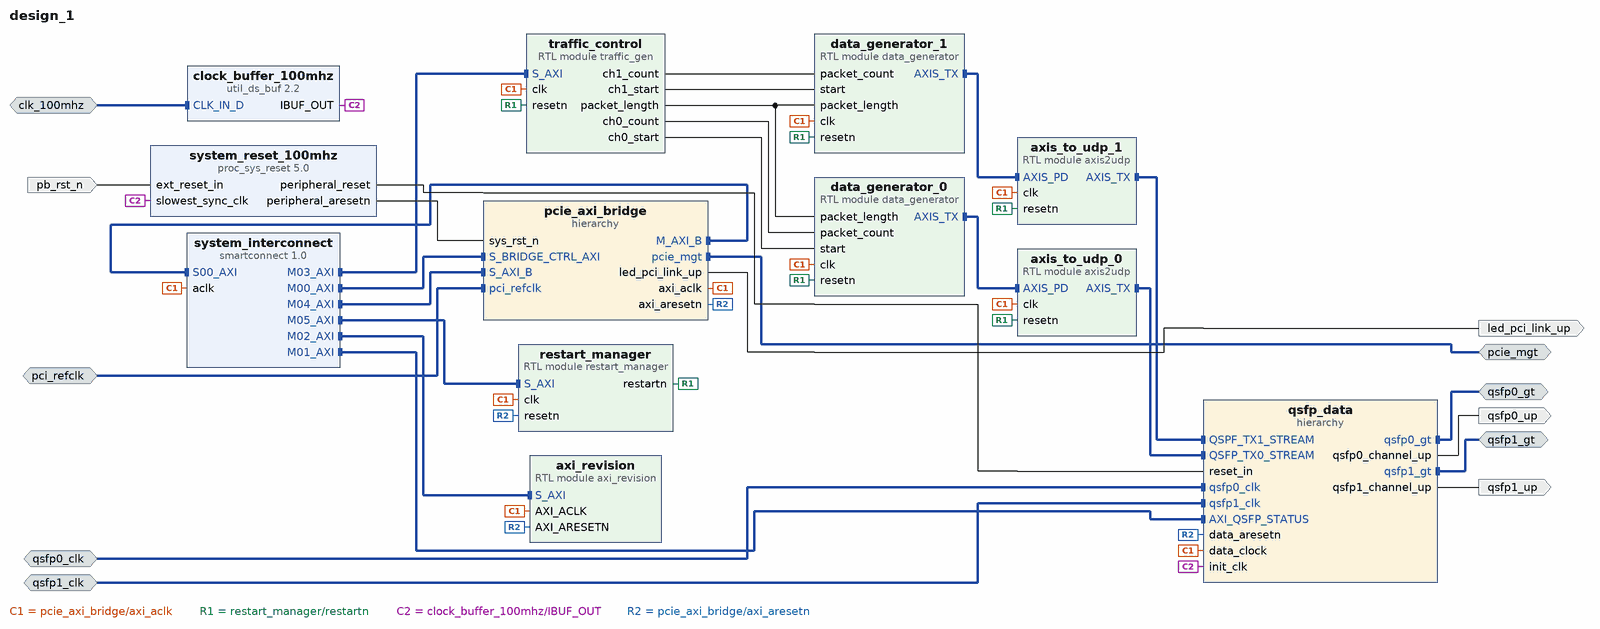
[diagram p0: block diagram of the top level]
# Vivado block design design_1, xczu19eg-ffvc1760-2-i, Vivado 2021.1
create_bd_design design_1

create_bd_intf_port -mode Slave -vlnv xilinx.com:interface:diff_clock_rtl:1.0 clk_100mhz
create_bd_intf_port -mode Slave -vlnv xilinx.com:interface:diff_clock_rtl:1.0 pci_refclk
create_bd_intf_port -mode Master -vlnv xilinx.com:interface:pcie_7x_mgt_rtl:1.0 pcie_mgt
create_bd_intf_port -mode Slave -vlnv xilinx.com:interface:diff_clock_rtl:1.0 qsfp0_clk
set_property -dict {CONFIG.FREQ_HZ 322265625} [get_bd_intf_ports qsfp0_clk]
create_bd_intf_port -mode Slave -vlnv xilinx.com:interface:diff_clock_rtl:1.0 qsfp1_clk
set_property -dict {CONFIG.FREQ_HZ 322265625} [get_bd_intf_ports qsfp1_clk]
create_bd_intf_port -mode Master -vlnv xilinx.com:interface:gt_rtl:1.0 qsfp0_gt
create_bd_intf_port -mode Master -vlnv xilinx.com:interface:gt_rtl:1.0 qsfp1_gt
create_bd_port -dir I -type rst pb_rst_n
create_bd_port -dir O led_pci_link_up
create_bd_port -dir O qsfp0_up
create_bd_port -dir O qsfp1_up

create_bd_cell -type ip -vlnv xilinx.com:ip:proc_sys_reset:5.0 system_reset_100mhz
create_bd_cell -type ip -vlnv xilinx.com:ip:util_ds_buf:2.2 clock_buffer_100mhz
create_bd_cell -type hier pcie_axi_bridge
create_bd_cell -type hier qsfp_data
create_bd_cell -type module -reference restart_manager restart_manager
create_bd_cell -type ip -vlnv xilinx.com:ip:smartconnect:1.0 system_interconnect
set_property -dict {CONFIG.HAS_ARESETN 0 CONFIG.NUM_CLKS 1 CONFIG.NUM_MI 6 CONFIG.NUM_SI 1} [get_bd_cells system_interconnect]
create_bd_cell -type module -reference traffic_gen traffic_control
create_bd_cell -type module -reference axi_revision axi_revision
create_bd_cell -type module -reference data_generator data_generator_0
create_bd_cell -type module -reference data_generator data_generator_1
create_bd_cell -type module -reference axis2udp axis_to_udp_0
set_property -dict {CONFIG.DST_PORT 32002 CONFIG.SRC_MAC 2} [get_bd_cells axis_to_udp_0]
create_bd_cell -type module -reference axis2udp axis_to_udp_1
set_property -dict {CONFIG.DST_PORT 32003 CONFIG.SRC_IP3 3 CONFIG.SRC_MAC 3} [get_bd_cells axis_to_udp_1]

# ---- hierarchy /pcie_axi_bridge ----
current_bd_instance /pcie_axi_bridge
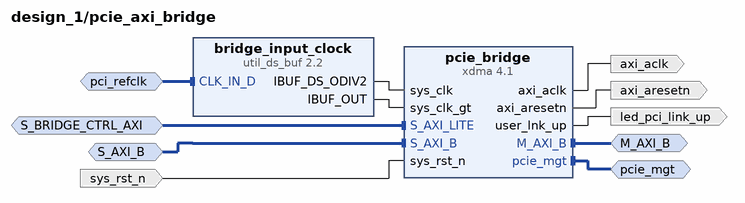
[diagram p1: block diagram inside /pcie_axi_bridge]
create_bd_intf_pin -mode Slave -vlnv xilinx.com:interface:aximm_rtl:1.0 S_BRIDGE_CTRL_AXI
create_bd_intf_pin -mode Slave -vlnv xilinx.com:interface:aximm_rtl:1.0 S_AXI_B
create_bd_intf_pin -mode Master -vlnv xilinx.com:interface:pcie_7x_mgt_rtl:1.0 pcie_mgt
create_bd_intf_pin -mode Master -vlnv xilinx.com:interface:aximm_rtl:1.0 M_AXI_B
create_bd_intf_pin -mode Slave -vlnv xilinx.com:interface:diff_clock_rtl:1.0 pci_refclk
create_bd_pin -dir O -type rst axi_aresetn
create_bd_pin -dir O -type clk axi_aclk
create_bd_pin -dir O led_pci_link_up
create_bd_pin -dir I -type rst sys_rst_n

create_bd_cell -type ip -vlnv xilinx.com:ip:xdma:4.1 pcie_bridge
set_property -dict [list \
  CONFIG.PF0_DEVICE_ID_mqdma 903F \
  CONFIG.PF0_SRIOV_VF_DEVICE_ID A03F \
  CONFIG.PF2_DEVICE_ID_mqdma 923F \
  CONFIG.PF3_DEVICE_ID_mqdma 933F \
  CONFIG.axi_addr_width 64 \
  CONFIG.axi_data_width 512_bit \
  CONFIG.axibar2pciebar_0 0x0 \
  CONFIG.axibar_num 1 \
  CONFIG.axilite_master_en true \
  CONFIG.axilite_master_size 8 \
  CONFIG.axisten_freq 250 \
  CONFIG.bridge_burst true \
  CONFIG.c_s_axi_supports_narrow_burst false \
  CONFIG.cfg_mgmt_if false \
  CONFIG.enable_jtag_dbg true \
  CONFIG.functional_mode AXI_Bridge \
  CONFIG.mode_selection Advanced \
  CONFIG.pcie_blk_locn X1Y0 \
  CONFIG.pcie_extended_tag false \
  CONFIG.pciebar2axibar_0 0x00000000 \
  CONFIG.pciebar2axibar_1 0x800000000 \
  CONFIG.pciebar2axibar_axil_master 0A0000000 \
  CONFIG.pf0_Use_Class_Code_Lookup_Assistant false \
  CONFIG.pf0_bar0_64bit false \
  CONFIG.pf0_bar0_scale Megabytes \
  CONFIG.pf0_bar0_size 1 \
  CONFIG.pf0_bar1_enabled true \
  CONFIG.pf0_bar1_scale Megabytes \
  CONFIG.pf0_bar1_size 1 \
  CONFIG.pf0_bar2_enabled false \
  CONFIG.pf0_base_class_menu Simple_communication_controllers \
  CONFIG.pf0_class_code_base 07 \
  CONFIG.pf0_class_code_interface 01 \
  CONFIG.pf0_class_code_sub 00 \
  CONFIG.pf0_device_id 903F \
  CONFIG.pf0_interrupt_pin INTA \
  CONFIG.pf0_msi_enabled false \
  CONFIG.pf0_sub_class_interface_menu 16450_compatible_serial_controller \
  CONFIG.pf0_subsystem_id 0007 \
  CONFIG.pl_link_cap_max_link_speed 8.0_GT/s \
  CONFIG.pl_link_cap_max_link_width X16 \
  CONFIG.plltype QPLL1 \
  CONFIG.xdma_num_usr_irq 1 \
  CONFIG.xdma_sts_ports false \
  CONFIG.xdma_wnum_rids 32 \
] [get_bd_cells pcie_bridge]
create_bd_cell -type ip -vlnv xilinx.com:ip:util_ds_buf:2.2 bridge_input_clock
set_property -dict {CONFIG.C_BUF_TYPE IBUFDSGTE} [get_bd_cells bridge_input_clock]

# ---- hierarchy /qsfp_data ----
current_bd_instance /qsfp_data
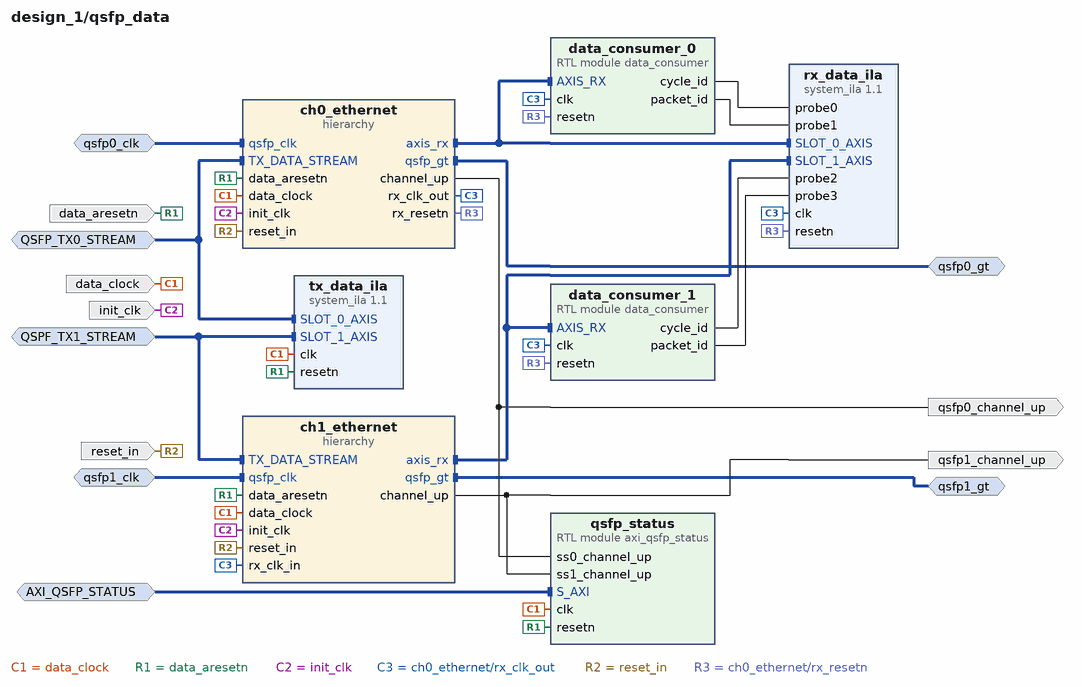
[diagram p2: block diagram inside /qsfp_data]
create_bd_intf_pin -mode Slave -vlnv xilinx.com:interface:diff_clock_rtl:1.0 qsfp0_clk
create_bd_intf_pin -mode Slave -vlnv xilinx.com:interface:diff_clock_rtl:1.0 qsfp1_clk
create_bd_intf_pin -mode Slave -vlnv xilinx.com:interface:axis_rtl:1.0 QSFP_TX0_STREAM
create_bd_intf_pin -mode Slave -vlnv xilinx.com:interface:aximm_rtl:1.0 AXI_QSFP_STATUS
create_bd_intf_pin -mode Master -vlnv xilinx.com:interface:gt_rtl:1.0 qsfp0_gt
create_bd_intf_pin -mode Master -vlnv xilinx.com:interface:gt_rtl:1.0 qsfp1_gt
create_bd_intf_pin -mode Slave -vlnv xilinx.com:interface:axis_rtl:1.0 QSPF_TX1_STREAM
create_bd_pin -dir I -type clk init_clk
create_bd_pin -dir I -type rst reset_in
create_bd_pin -dir O qsfp0_channel_up
create_bd_pin -dir O qsfp1_channel_up
create_bd_pin -dir I -type clk data_clock
create_bd_pin -dir I -type rst data_aresetn

create_bd_cell -type hier ch0_ethernet
create_bd_cell -type hier ch1_ethernet
create_bd_cell -type module -reference axi_qsfp_status qsfp_status
create_bd_cell -type ip -vlnv xilinx.com:ip:system_ila:1.1 tx_data_ila
set_property -dict [list \
  CONFIG.C_DATA_DEPTH 2048 \
  CONFIG.C_MON_TYPE INTERFACE \
  CONFIG.C_NUM_MONITOR_SLOTS 2 \
  CONFIG.C_NUM_OF_PROBES 1 \
  CONFIG.C_PROBE0_TYPE 0 \
  CONFIG.C_PROBE1_TYPE 0 \
  CONFIG.C_SLOT 1 \
  CONFIG.C_SLOT_0_INTF_TYPE xilinx.com:interface:axis_rtl:1.0 \
  CONFIG.C_SLOT_1_INTF_TYPE xilinx.com:interface:axis_rtl:1.0 \
] [get_bd_cells tx_data_ila]
create_bd_cell -type module -reference data_consumer data_consumer_0
create_bd_cell -type module -reference data_consumer data_consumer_1
create_bd_cell -type ip -vlnv xilinx.com:ip:system_ila:1.1 rx_data_ila
set_property -dict [list \
  CONFIG.C_MON_TYPE MIX \
  CONFIG.C_NUM_MONITOR_SLOTS 2 \
  CONFIG.C_NUM_OF_PROBES 4 \
  CONFIG.C_PROBE0_TYPE 0 \
  CONFIG.C_PROBE1_TYPE 0 \
  CONFIG.C_PROBE2_TYPE 0 \
  CONFIG.C_PROBE3_TYPE 0 \
  CONFIG.C_SLOT_0_APC_EN 0 \
  CONFIG.C_SLOT_0_AXI_DATA_SEL 1 \
  CONFIG.C_SLOT_0_AXI_TRIG_SEL 1 \
  CONFIG.C_SLOT_0_INTF_TYPE xilinx.com:interface:axis_rtl:1.0 \
  CONFIG.C_SLOT_1_APC_EN 0 \
  CONFIG.C_SLOT_1_AXI_DATA_SEL 1 \
  CONFIG.C_SLOT_1_AXI_TRIG_SEL 1 \
  CONFIG.C_SLOT_1_INTF_TYPE xilinx.com:interface:axis_rtl:1.0 \
] [get_bd_cells rx_data_ila]

# ---- hierarchy /qsfp_data/ch0_ethernet ----
current_bd_instance /qsfp_data/ch0_ethernet
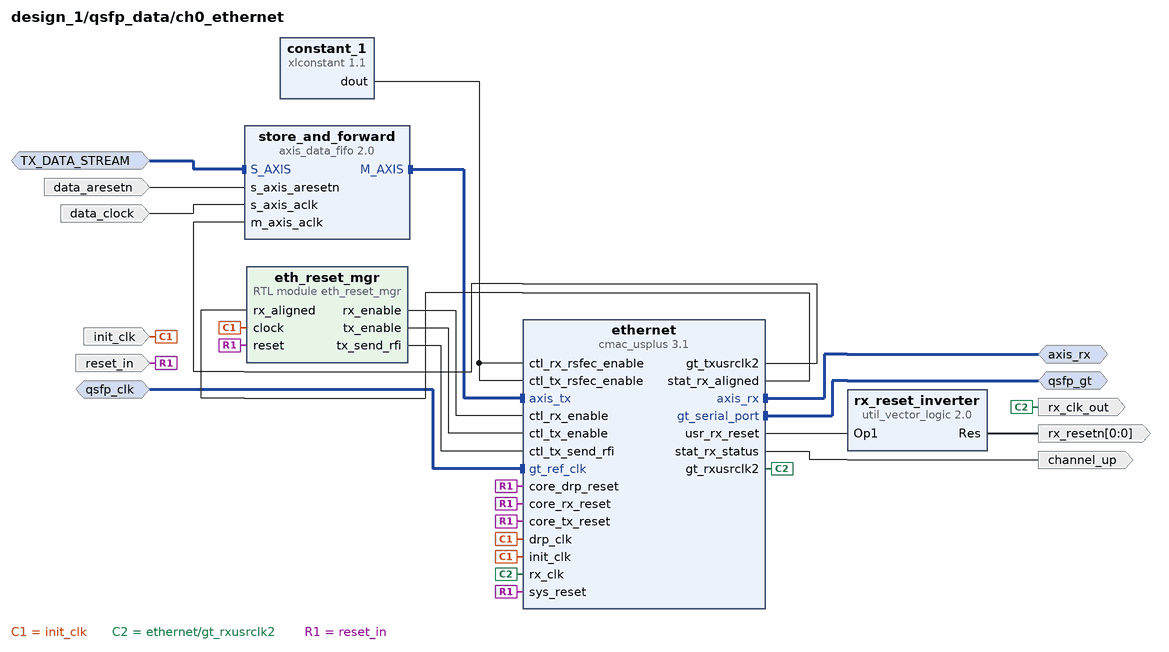
[diagram p3: block diagram inside /qsfp_data/ch0_ethernet]
create_bd_intf_pin -mode Master -vlnv xilinx.com:interface:gt_rtl:1.0 qsfp_gt
create_bd_intf_pin -mode Slave -vlnv xilinx.com:interface:diff_clock_rtl:1.0 qsfp_clk
create_bd_intf_pin -mode Master -vlnv xilinx.com:interface:axis_rtl:1.0 axis_rx
create_bd_intf_pin -mode Slave -vlnv xilinx.com:interface:axis_rtl:1.0 TX_DATA_STREAM
create_bd_pin -dir I -type rst reset_in
create_bd_pin -dir I -type clk init_clk
create_bd_pin -dir O -type clk rx_clk_out
create_bd_pin -dir O channel_up
create_bd_pin -dir I -type rst data_aresetn
create_bd_pin -dir I -type clk data_clock
create_bd_pin -dir O -from 0 -to 0 rx_resetn

create_bd_cell -type ip -vlnv xilinx.com:ip:cmac_usplus:3.1 ethernet
set_property -dict [list \
  CONFIG.CMAC_CAUI4_MODE 1 \
  CONFIG.CMAC_CORE_SELECT CMACE4_X0Y1 \
  CONFIG.GT_GROUP_SELECT {X0Y12~X0Y15} \
  CONFIG.GT_REF_CLK_FREQ 322.265625 \
  CONFIG.INCLUDE_RS_FEC 1 \
  CONFIG.INS_LOSS_NYQ 20 \
  CONFIG.NUM_LANES 4x25 \
  CONFIG.RX_FLOW_CONTROL 0 \
  CONFIG.TX_FLOW_CONTROL 0 \
  CONFIG.USER_INTERFACE AXIS \
] [get_bd_cells ethernet]
create_bd_cell -type module -reference eth_reset_mgr eth_reset_mgr
create_bd_cell -type ip -vlnv xilinx.com:ip:util_vector_logic:2.0 rx_reset_inverter
set_property -dict {CONFIG.C_OPERATION not CONFIG.C_SIZE 1} [get_bd_cells rx_reset_inverter]
create_bd_cell -type ip -vlnv xilinx.com:ip:axis_data_fifo:2.0 store_and_forward
set_property -dict {CONFIG.FIFO_DEPTH 256 CONFIG.FIFO_MODE 2 CONFIG.IS_ACLK_ASYNC 1} [get_bd_cells store_and_forward]
create_bd_cell -type ip -vlnv xilinx.com:ip:xlconstant:1.1 constant_1

# ---- hierarchy /qsfp_data/ch1_ethernet ----
current_bd_instance /qsfp_data/ch1_ethernet
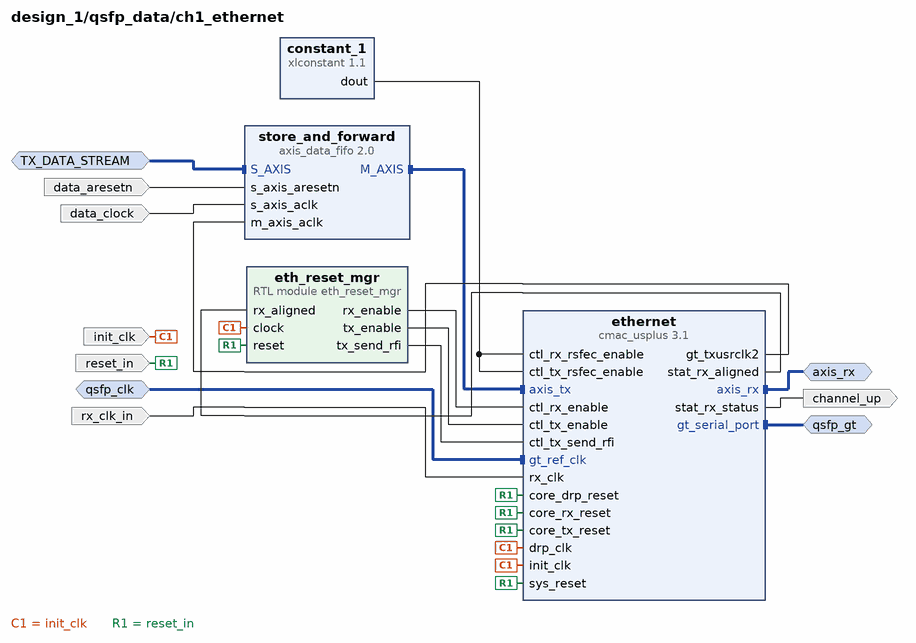
[diagram p4: block diagram inside /qsfp_data/ch1_ethernet]
create_bd_intf_pin -mode Master -vlnv xilinx.com:interface:gt_rtl:1.0 qsfp_gt
create_bd_intf_pin -mode Slave -vlnv xilinx.com:interface:diff_clock_rtl:1.0 qsfp_clk
create_bd_intf_pin -mode Master -vlnv xilinx.com:interface:axis_rtl:1.0 axis_rx
create_bd_intf_pin -mode Slave -vlnv xilinx.com:interface:axis_rtl:1.0 TX_DATA_STREAM
create_bd_pin -dir I -type rst reset_in
create_bd_pin -dir I -type clk init_clk
create_bd_pin -dir O channel_up
create_bd_pin -dir I -type rst data_aresetn
create_bd_pin -dir I -type clk data_clock
create_bd_pin -dir I -type clk rx_clk_in

create_bd_cell -type ip -vlnv xilinx.com:ip:cmac_usplus:3.1 ethernet
set_property -dict [list \
  CONFIG.CMAC_CAUI4_MODE 1 \
  CONFIG.CMAC_CORE_SELECT CMACE4_X0Y2 \
  CONFIG.GT_GROUP_SELECT {X0Y16~X0Y19} \
  CONFIG.GT_REF_CLK_FREQ 322.265625 \
  CONFIG.INCLUDE_RS_FEC 1 \
  CONFIG.INS_LOSS_NYQ 20 \
  CONFIG.NUM_LANES 4x25 \
  CONFIG.RX_FLOW_CONTROL 0 \
  CONFIG.TX_FLOW_CONTROL 0 \
  CONFIG.USER_INTERFACE AXIS \
] [get_bd_cells ethernet]
create_bd_cell -type module -reference eth_reset_mgr eth_reset_mgr
create_bd_cell -type ip -vlnv xilinx.com:ip:axis_data_fifo:2.0 store_and_forward
set_property -dict {CONFIG.FIFO_DEPTH 256 CONFIG.FIFO_MODE 2 CONFIG.IS_ACLK_ASYNC 1} [get_bd_cells store_and_forward]
create_bd_cell -type ip -vlnv xilinx.com:ip:xlconstant:1.1 constant_1

# ---- connections ----

current_bd_instance /pcie_axi_bridge
connect_bd_intf_net [get_bd_intf_pins S_BRIDGE_CTRL_AXI] [get_bd_intf_pins pcie_bridge/S_AXI_LITE]
connect_bd_intf_net [get_bd_intf_pins pcie_mgt] [get_bd_intf_pins pcie_bridge/pcie_mgt]
connect_bd_intf_net [get_bd_intf_pins M_AXI_B] [get_bd_intf_pins pcie_bridge/M_AXI_B]
connect_bd_intf_net [get_bd_intf_pins pci_refclk] [get_bd_intf_pins bridge_input_clock/CLK_IN_D]
connect_bd_intf_net [get_bd_intf_pins S_AXI_B] [get_bd_intf_pins pcie_bridge/S_AXI_B]
connect_bd_net [get_bd_pins bridge_input_clock/IBUF_DS_ODIV2] [get_bd_pins pcie_bridge/sys_clk]
connect_bd_net [get_bd_pins bridge_input_clock/IBUF_OUT] [get_bd_pins pcie_bridge/sys_clk_gt]
connect_bd_net [get_bd_pins pcie_bridge/axi_aclk] [get_bd_pins axi_aclk]
connect_bd_net [get_bd_pins pcie_bridge/axi_aresetn] [get_bd_pins axi_aresetn]
connect_bd_net [get_bd_pins pcie_bridge/user_lnk_up] [get_bd_pins led_pci_link_up]
connect_bd_net [get_bd_pins sys_rst_n] [get_bd_pins pcie_bridge/sys_rst_n]

current_bd_instance /qsfp_data
connect_bd_intf_net [get_bd_intf_pins QSPF_TX1_STREAM] [get_bd_intf_pins ch1_ethernet/TX_DATA_STREAM]
connect_bd_intf_net [get_bd_intf_pins QSPF_TX1_STREAM] [get_bd_intf_pins tx_data_ila/SLOT_1_AXIS]
connect_bd_intf_net [get_bd_intf_pins qsfp1_gt] [get_bd_intf_pins ch1_ethernet/qsfp_gt]
connect_bd_intf_net [get_bd_intf_pins AXI_QSFP_STATUS] [get_bd_intf_pins qsfp_status/S_AXI]
connect_bd_intf_net [get_bd_intf_pins qsfp0_gt] [get_bd_intf_pins ch0_ethernet/qsfp_gt]
connect_bd_intf_net [get_bd_intf_pins QSFP_TX0_STREAM] [get_bd_intf_pins ch0_ethernet/TX_DATA_STREAM]
connect_bd_intf_net [get_bd_intf_pins QSFP_TX0_STREAM] [get_bd_intf_pins tx_data_ila/SLOT_0_AXIS]
connect_bd_intf_net [get_bd_intf_pins data_consumer_0/AXIS_RX] [get_bd_intf_pins ch0_ethernet/axis_rx]
connect_bd_intf_net [get_bd_intf_pins data_consumer_0/AXIS_RX] [get_bd_intf_pins rx_data_ila/SLOT_0_AXIS]
connect_bd_intf_net [get_bd_intf_pins data_consumer_1/AXIS_RX] [get_bd_intf_pins ch1_ethernet/axis_rx]
connect_bd_intf_net [get_bd_intf_pins data_consumer_1/AXIS_RX] [get_bd_intf_pins rx_data_ila/SLOT_1_AXIS]
connect_bd_intf_net [get_bd_intf_pins qsfp0_clk] [get_bd_intf_pins ch0_ethernet/qsfp_clk]
connect_bd_intf_net [get_bd_intf_pins qsfp1_clk] [get_bd_intf_pins ch1_ethernet/qsfp_clk]
connect_bd_net -net aclk_1 [get_bd_pins data_clock] \
  [get_bd_pins ch1_ethernet/data_clock] [get_bd_pins ch0_ethernet/data_clock] [get_bd_pins qsfp_status/clk] \
  [get_bd_pins tx_data_ila/clk]
connect_bd_net -net aresetn_1 [get_bd_pins data_aresetn] \
  [get_bd_pins ch1_ethernet/data_aresetn] [get_bd_pins ch0_ethernet/data_aresetn] [get_bd_pins qsfp_status/resetn] \
  [get_bd_pins tx_data_ila/resetn]
connect_bd_net -net aurora_64b66b_0_channel_up [get_bd_pins ch0_ethernet/channel_up] \
  [get_bd_pins qsfp0_channel_up] [get_bd_pins qsfp_status/ss0_channel_up]
connect_bd_net -net aurora_core_1_channel_up [get_bd_pins ch1_ethernet/channel_up] \
  [get_bd_pins qsfp1_channel_up] [get_bd_pins qsfp_status/ss1_channel_up]
connect_bd_net -net clock_1 [get_bd_pins init_clk] [get_bd_pins ch0_ethernet/init_clk] [get_bd_pins ch1_ethernet/init_clk]
connect_bd_net -net cycle_id_1 [get_bd_pins data_consumer_0/cycle_id] [get_bd_pins rx_data_ila/probe0]
connect_bd_net -net cycle_id_2 [get_bd_pins data_consumer_1/cycle_id] [get_bd_pins rx_data_ila/probe2]
connect_bd_net -net packet_id_1 [get_bd_pins data_consumer_0/packet_id] [get_bd_pins rx_data_ila/probe1]
connect_bd_net -net packet_id_2 [get_bd_pins data_consumer_1/packet_id] [get_bd_pins rx_data_ila/probe3]
connect_bd_net -net qsfp0_ethernet_gt_rxusrclk2 [get_bd_pins ch0_ethernet/rx_clk_out] \
  [get_bd_pins ch1_ethernet/rx_clk_in] [get_bd_pins data_consumer_0/clk] [get_bd_pins data_consumer_1/clk] \
  [get_bd_pins rx_data_ila/clk]
connect_bd_net [get_bd_pins reset_in] [get_bd_pins ch0_ethernet/reset_in] [get_bd_pins ch1_ethernet/reset_in]
connect_bd_net -net reset_inverter_1_Res [get_bd_pins ch0_ethernet/rx_resetn] \
  [get_bd_pins data_consumer_0/resetn] [get_bd_pins data_consumer_1/resetn] [get_bd_pins rx_data_ila/resetn]
set_property HDL_ATTRIBUTE.DEBUG true [get_bd_nets cycle_id_1]
set_property HDL_ATTRIBUTE.MARK_DEBUG true [get_bd_nets cycle_id_1]
set_property HDL_ATTRIBUTE.DEBUG true [get_bd_nets cycle_id_2]
set_property HDL_ATTRIBUTE.MARK_DEBUG true [get_bd_nets cycle_id_2]
set_property HDL_ATTRIBUTE.DEBUG true [get_bd_nets packet_id_1]
set_property HDL_ATTRIBUTE.MARK_DEBUG true [get_bd_nets packet_id_1]
set_property HDL_ATTRIBUTE.DEBUG true [get_bd_nets packet_id_2]
set_property HDL_ATTRIBUTE.MARK_DEBUG true [get_bd_nets packet_id_2]

current_bd_instance /qsfp_data/ch0_ethernet
connect_bd_intf_net [get_bd_intf_pins qsfp_gt] [get_bd_intf_pins ethernet/gt_serial_port]
connect_bd_intf_net [get_bd_intf_pins TX_DATA_STREAM] [get_bd_intf_pins store_and_forward/S_AXIS]
connect_bd_intf_net [get_bd_intf_pins qsfp_clk] [get_bd_intf_pins ethernet/gt_ref_clk]
connect_bd_intf_net [get_bd_intf_pins axis_rx] [get_bd_intf_pins ethernet/axis_rx]
connect_bd_intf_net [get_bd_intf_pins ethernet/axis_tx] [get_bd_intf_pins store_and_forward/M_AXIS]
connect_bd_net -net aurora_64b66b_0_channel_up [get_bd_pins ethernet/stat_rx_status] [get_bd_pins channel_up]
connect_bd_net -net clock_1 [get_bd_pins init_clk] [get_bd_pins ethernet/drp_clk] [get_bd_pins ethernet/init_clk] [get_bd_pins eth_reset_mgr/clock]
connect_bd_net [get_bd_pins constant_1/dout] [get_bd_pins ethernet/ctl_rx_rsfec_enable] [get_bd_pins ethernet/ctl_tx_rsfec_enable]
connect_bd_net [get_bd_pins data_aresetn] [get_bd_pins store_and_forward/s_axis_aresetn]
connect_bd_net [get_bd_pins data_clock] [get_bd_pins store_and_forward/s_axis_aclk]
connect_bd_net -net eth_reset_mgr_0_rx_enable [get_bd_pins eth_reset_mgr/rx_enable] [get_bd_pins ethernet/ctl_rx_enable]
connect_bd_net -net eth_reset_mgr_0_tx_enable [get_bd_pins eth_reset_mgr/tx_enable] [get_bd_pins ethernet/ctl_tx_enable]
connect_bd_net -net eth_reset_mgr_0_tx_send_rfi [get_bd_pins eth_reset_mgr/tx_send_rfi] [get_bd_pins ethernet/ctl_tx_send_rfi]
connect_bd_net [get_bd_pins ethernet/gt_txusrclk2] [get_bd_pins store_and_forward/m_axis_aclk]
connect_bd_net [get_bd_pins ethernet/stat_rx_aligned] [get_bd_pins eth_reset_mgr/rx_aligned]
connect_bd_net [get_bd_pins ethernet/usr_rx_reset] [get_bd_pins rx_reset_inverter/Op1]
connect_bd_net -net qsfp0_ethernet_gt_rxusrclk2 [get_bd_pins ethernet/gt_rxusrclk2] [get_bd_pins rx_clk_out] [get_bd_pins ethernet/rx_clk]
connect_bd_net [get_bd_pins reset_in] \
  [get_bd_pins ethernet/core_tx_reset] [get_bd_pins ethernet/core_rx_reset] [get_bd_pins ethernet/core_drp_reset] \
  [get_bd_pins ethernet/sys_reset] [get_bd_pins eth_reset_mgr/reset]
connect_bd_net [get_bd_pins rx_reset_inverter/Res] [get_bd_pins rx_resetn]

current_bd_instance /qsfp_data/ch1_ethernet
connect_bd_intf_net [get_bd_intf_pins qsfp_gt] [get_bd_intf_pins ethernet/gt_serial_port]
connect_bd_intf_net [get_bd_intf_pins TX_DATA_STREAM] [get_bd_intf_pins store_and_forward/S_AXIS]
connect_bd_intf_net [get_bd_intf_pins qsfp_clk] [get_bd_intf_pins ethernet/gt_ref_clk]
connect_bd_intf_net [get_bd_intf_pins axis_rx] [get_bd_intf_pins ethernet/axis_rx]
connect_bd_intf_net [get_bd_intf_pins store_and_forward/M_AXIS] [get_bd_intf_pins ethernet/axis_tx]
connect_bd_net -net aurora_core_1_channel_up [get_bd_pins ethernet/stat_rx_status] [get_bd_pins channel_up]
connect_bd_net -net clock_1 [get_bd_pins init_clk] [get_bd_pins ethernet/drp_clk] [get_bd_pins ethernet/init_clk] [get_bd_pins eth_reset_mgr/clock]
connect_bd_net [get_bd_pins constant_1/dout] [get_bd_pins ethernet/ctl_rx_rsfec_enable] [get_bd_pins ethernet/ctl_tx_rsfec_enable]
connect_bd_net [get_bd_pins data_aresetn] [get_bd_pins store_and_forward/s_axis_aresetn]
connect_bd_net [get_bd_pins data_clock] [get_bd_pins store_and_forward/s_axis_aclk]
connect_bd_net [get_bd_pins eth_reset_mgr/rx_enable] [get_bd_pins ethernet/ctl_rx_enable]
connect_bd_net [get_bd_pins eth_reset_mgr/tx_enable] [get_bd_pins ethernet/ctl_tx_enable]
connect_bd_net [get_bd_pins eth_reset_mgr/tx_send_rfi] [get_bd_pins ethernet/ctl_tx_send_rfi]
connect_bd_net -net ethernet_core_gt_txusrclk2 [get_bd_pins ethernet/gt_txusrclk2] [get_bd_pins store_and_forward/m_axis_aclk]
connect_bd_net [get_bd_pins ethernet/stat_rx_aligned] [get_bd_pins eth_reset_mgr/rx_aligned]
connect_bd_net [get_bd_pins reset_in] \
  [get_bd_pins ethernet/core_rx_reset] [get_bd_pins ethernet/core_tx_reset] [get_bd_pins ethernet/core_drp_reset] \
  [get_bd_pins ethernet/sys_reset] [get_bd_pins eth_reset_mgr/reset]
connect_bd_net -net rx_clk_0_1 [get_bd_pins rx_clk_in] [get_bd_pins ethernet/rx_clk]

current_bd_instance /
connect_bd_intf_net [get_bd_intf_ports clk_100mhz] [get_bd_intf_pins clock_buffer_100mhz/CLK_IN_D]
connect_bd_intf_net [get_bd_intf_ports qsfp0_clk] [get_bd_intf_pins qsfp_data/qsfp0_clk]
connect_bd_intf_net [get_bd_intf_ports qsfp1_clk] [get_bd_intf_pins qsfp_data/qsfp1_clk]
connect_bd_intf_net [get_bd_intf_pins qsfp_data/QSFP_TX0_STREAM] [get_bd_intf_pins axis_to_udp_0/AXIS_TX]
connect_bd_intf_net [get_bd_intf_pins axis_to_udp_1/AXIS_TX] [get_bd_intf_pins qsfp_data/QSPF_TX1_STREAM]
connect_bd_intf_net [get_bd_intf_pins data_generator_0/AXIS_TX] [get_bd_intf_pins axis_to_udp_0/AXIS_PD]
connect_bd_intf_net [get_bd_intf_pins data_generator_1/AXIS_TX] [get_bd_intf_pins axis_to_udp_1/AXIS_PD]
connect_bd_intf_net [get_bd_intf_ports pci_refclk] [get_bd_intf_pins pcie_axi_bridge/pci_refclk]
connect_bd_intf_net [get_bd_intf_pins pcie_axi_bridge/M_AXI_B] [get_bd_intf_pins system_interconnect/S00_AXI]
connect_bd_intf_net [get_bd_intf_ports pcie_mgt] [get_bd_intf_pins pcie_axi_bridge/pcie_mgt]
connect_bd_intf_net [get_bd_intf_ports qsfp0_gt] [get_bd_intf_pins qsfp_data/qsfp0_gt]
connect_bd_intf_net [get_bd_intf_ports qsfp1_gt] [get_bd_intf_pins qsfp_data/qsfp1_gt]
connect_bd_intf_net [get_bd_intf_pins system_interconnect/M00_AXI] [get_bd_intf_pins pcie_axi_bridge/S_BRIDGE_CTRL_AXI]
connect_bd_intf_net [get_bd_intf_pins system_interconnect/M01_AXI] [get_bd_intf_pins qsfp_data/AXI_QSFP_STATUS]
connect_bd_intf_net [get_bd_intf_pins axi_revision/S_AXI] [get_bd_intf_pins system_interconnect/M02_AXI]
connect_bd_intf_net [get_bd_intf_pins traffic_control/S_AXI] [get_bd_intf_pins system_interconnect/M03_AXI]
connect_bd_intf_net [get_bd_intf_pins system_interconnect/M04_AXI] [get_bd_intf_pins pcie_axi_bridge/S_AXI_B]
connect_bd_intf_net [get_bd_intf_pins system_interconnect/M05_AXI] [get_bd_intf_pins restart_manager/S_AXI]
connect_bd_net -net ext_reset_in_0_1 [get_bd_ports pb_rst_n] [get_bd_pins system_reset_100mhz/ext_reset_in]
connect_bd_net -net ila_250mhz [get_bd_pins pcie_axi_bridge/axi_aclk] \
  [get_bd_pins restart_manager/clk] [get_bd_pins system_interconnect/aclk] [get_bd_pins qsfp_data/data_clock] \
  [get_bd_pins traffic_control/clk] [get_bd_pins axi_revision/AXI_ACLK] [get_bd_pins data_generator_0/clk] \
  [get_bd_pins data_generator_1/clk] [get_bd_pins axis_to_udp_0/clk] [get_bd_pins axis_to_udp_1/clk]
connect_bd_net [get_bd_pins pcie_axi_bridge/led_pci_link_up] [get_bd_ports led_pci_link_up]
connect_bd_net -net qsfp_data_channel_up_0 [get_bd_pins qsfp_data/qsfp0_channel_up] [get_bd_ports qsfp0_up]
connect_bd_net -net qsfp_data_channel_up_1 [get_bd_pins qsfp_data/qsfp1_channel_up] [get_bd_ports qsfp1_up]
connect_bd_net -net reset_in_1 [get_bd_pins system_reset_100mhz/peripheral_reset] [get_bd_pins qsfp_data/reset_in]
connect_bd_net -net restartn [get_bd_pins restart_manager/restartn] \
  [get_bd_pins traffic_control/resetn] [get_bd_pins data_generator_0/resetn] [get_bd_pins data_generator_1/resetn] \
  [get_bd_pins axis_to_udp_0/resetn] [get_bd_pins axis_to_udp_1/resetn]
connect_bd_net [get_bd_pins system_reset_100mhz/peripheral_aresetn] [get_bd_pins pcie_axi_bridge/sys_rst_n]
connect_bd_net [get_bd_pins traffic_control/ch0_count] [get_bd_pins data_generator_0/packet_count]
connect_bd_net [get_bd_pins traffic_control/ch0_start] [get_bd_pins data_generator_0/start]
connect_bd_net [get_bd_pins traffic_control/ch1_count] [get_bd_pins data_generator_1/packet_count]
connect_bd_net [get_bd_pins traffic_control/ch1_start] [get_bd_pins data_generator_1/start]
connect_bd_net [get_bd_pins traffic_control/packet_length] [get_bd_pins data_generator_0/packet_length] [get_bd_pins data_generator_1/packet_length]
connect_bd_net -net util_ds_buf_0_IBUF_OUT [get_bd_pins clock_buffer_100mhz/IBUF_OUT] \
  [get_bd_pins system_reset_100mhz/slowest_sync_clk] [get_bd_pins qsfp_data/init_clk]
connect_bd_net -net xdma_0_axi_aresetn [get_bd_pins pcie_axi_bridge/axi_aresetn] \
  [get_bd_pins restart_manager/resetn] [get_bd_pins qsfp_data/data_aresetn] [get_bd_pins axi_revision/AXI_ARESETN]

# ---- address map ----
assign_bd_address -offset 0x0000000000000000 -range 256 -target_address_space [get_bd_addr_spaces pcie_axi_bridge/pcie_bridge/M_AXI_B] [get_bd_addr_segs axi_revision/S_AXI/reg0]
assign_bd_address -offset 0x0000000000000300 -range 256 -target_address_space [get_bd_addr_spaces pcie_axi_bridge/pcie_bridge/M_AXI_B] [get_bd_addr_segs restart_manager/S_AXI/reg0]
assign_bd_address -offset 0x0000000000000500 -range 256 -target_address_space [get_bd_addr_spaces pcie_axi_bridge/pcie_bridge/M_AXI_B] [get_bd_addr_segs qsfp_data/qsfp_status/S_AXI/reg0]
assign_bd_address -offset 0x0000000000001000 -range 256 -target_address_space [get_bd_addr_spaces pcie_axi_bridge/pcie_bridge/M_AXI_B] [get_bd_addr_segs traffic_control/S_AXI/reg0]
assign_bd_address -offset 0x000000000000F000 -range 256 -target_address_space [get_bd_addr_spaces pcie_axi_bridge/pcie_bridge/M_AXI_B] [get_bd_addr_segs pcie_axi_bridge/pcie_bridge/S_AXI_LITE/CTL0]
assign_bd_address -offset 0x0000000076000000 -range 1M -target_address_space [get_bd_addr_spaces pcie_axi_bridge/pcie_bridge/M_AXI_B] [get_bd_addr_segs pcie_axi_bridge/pcie_bridge/S_AXI_B/BAR0]

validate_bd_design
save_bd_design
